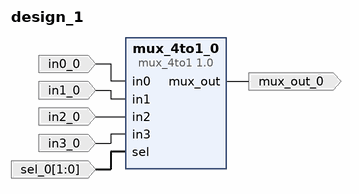
[diagram p0: block diagram of the top level]
# Vivado block design design_1, xc7a35ticpg236-1L, Vivado 2025.1
create_bd_design design_1

create_bd_port -dir I in0_0
create_bd_port -dir I in1_0
create_bd_port -dir I in2_0
create_bd_port -dir I in3_0
create_bd_port -dir O mux_out_0
create_bd_port -dir I -from 1 -to 0 sel_0

create_bd_cell -type ip -vlnv xilinx.com:user:mux_4to1:1.0 mux_4to1_0

# ---- connections ----

connect_bd_net -net in0_0_1 [get_bd_ports in0_0] [get_bd_pins mux_4to1_0/in0]
connect_bd_net -net in1_0_1 [get_bd_ports in1_0] [get_bd_pins mux_4to1_0/in1]
connect_bd_net -net in2_0_1 [get_bd_ports in2_0] [get_bd_pins mux_4to1_0/in2]
connect_bd_net -net in3_0_1 [get_bd_ports in3_0] [get_bd_pins mux_4to1_0/in3]
connect_bd_net [get_bd_pins mux_4to1_0/mux_out] [get_bd_ports mux_out_0]
connect_bd_net -net sel_0_1 [get_bd_ports sel_0] [get_bd_pins mux_4to1_0/sel]

validate_bd_design
save_bd_design
